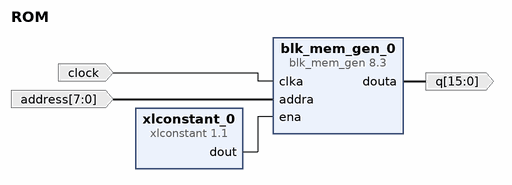
[diagram p0: block diagram of the top level]
# Vivado block design ROM, xc7a35tcpg236-1, Vivado 2017.1
create_bd_design ROM

create_bd_port -dir O -from 15 -to 0 q
create_bd_port -dir I -type clk clock
create_bd_port -dir I -from 7 -to 0 address

create_bd_cell -type ip -vlnv xilinx.com:ip:blk_mem_gen:8.3 blk_mem_gen_0
set_property -dict [list \
  CONFIG.Memory_Type Single_Port_ROM \
  CONFIG.Enable_32bit_Address false \
  CONFIG.Write_Width_A 16 \
  CONFIG.Write_Depth_A 256 \
  CONFIG.Register_PortA_Output_of_Memory_Primitives false \
  CONFIG.Load_Init_File true \
  CONFIG.Coe_File ROM.coe \
  CONFIG.Use_RSTA_Pin false \
  CONFIG.Port_A_Write_Rate 0 \
  CONFIG.Port_B_Clock 0 \
  CONFIG.Port_B_Enable_Rate 0 \
  CONFIG.use_bram_block Stand_Alone \
] [get_bd_cells blk_mem_gen_0]
create_bd_cell -type ip -vlnv xilinx.com:ip:xlconstant:1.1 xlconstant_0

# ---- connections ----

connect_bd_net [get_bd_pins blk_mem_gen_0/douta] [get_bd_ports q]
connect_bd_net [get_bd_ports clock] [get_bd_pins blk_mem_gen_0/clka]
connect_bd_net [get_bd_ports address] [get_bd_pins blk_mem_gen_0/addra]
connect_bd_net [get_bd_pins xlconstant_0/dout] [get_bd_pins blk_mem_gen_0/ena]

validate_bd_design
save_bd_design
